# Altium project OnLab_Vezerlo.PrjPcb
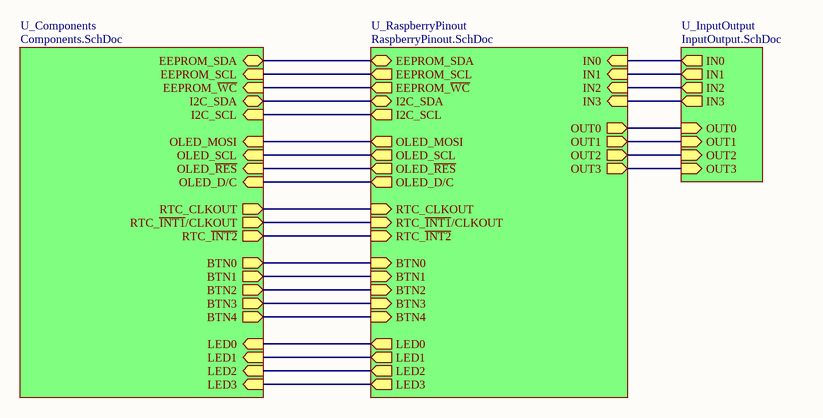
[diagram p0: TOP.SchDoc]
4 sheets, 86 parts. Net scope: hierarchical (ports join the sheet entries above them; power ports are global).
Board file: RaspberryHatBoard.PcbDoc
Sheets:
  TOP.SchDoc
    U_RaspberryPinout = RaspberryPinout.SchDoc
    U_Components = Components.SchDoc
    U_InputOutput = InputOutput.SchDoc

## Sheet TOP.SchDoc: Okos otthon vezérlő HAT
size A4; Author: Bencsik Dániel Zoltán; Organization: BME VIK AUT; DocumentNumber: 1; SheetNumber: 1; SheetTotal: 4

### Sub-sheets
U_Components = Components.SchDoc: EEPROM_SDA (bidir), EEPROM_SCL (in), EEPROM_~{WC} (in), RTC_~{INT1}/CLKOUT (out), RTC_CLKOUT (out), RTC_~{INT2} (out), LED0 (in), LED1 (in), LED2 (in), LED3 (in), BTN0 (out), BTN1 (out), BTN2 (out), BTN3 (out), BTN4 (out), OLED_SCL (in), OLED_MOSI (in), OLED_~{RES} (in), OLED_D/C (in), I2C_SCL (in), I2C_SDA (bidir)
U_InputOutput = InputOutput.SchDoc: IN0 (out), IN1 (out), IN2 (out), IN3 (out), OUT0 (in), OUT1 (in), OUT2 (in), OUT3 (in)
U_RaspberryPinout = RaspberryPinout.SchDoc: EEPROM_SDA (bidir), EEPROM_SCL (out), IN3 (in), IN2 (in), IN1 (in), IN0 (in), EEPROM_~{WC} (out), RTC_CLKOUT (in), RTC_~{INT1}/CLKOUT (in), BTN4 (in), BTN3 (in), BTN2 (in), BTN1 (in), BTN0 (in), RTC_~{INT2} (in), OLED_SCL (out), OLED_~{RES} (out), OLED_D/C (out), OLED_MOSI (out), LED3 (out), LED2 (out), LED1 (out), LED0 (out), I2C_SDA (bidir), I2C_SCL (out), OUT0 (out), OUT1 (out), OUT2 (out), OUT3 (out)

### Nets
NetC2_2: sheet U_RaspberryPinout/BTN0, sheet U_Components/BTN0
NetC3_2: sheet U_RaspberryPinout/BTN1, sheet U_Components/BTN1
NetC4_2: sheet U_RaspberryPinout/BTN2, sheet U_Components/BTN2
NetC5_2: sheet U_RaspberryPinout/BTN3, sheet U_Components/BTN3
NetC6_2: sheet U_RaspberryPinout/BTN4, sheet U_Components/BTN4
NetE1_5: sheet U_RaspberryPinout/EEPROM_SDA, sheet U_Components/EEPROM_SDA
NetE1_6: sheet U_RaspberryPinout/EEPROM_SCL, sheet U_Components/EEPROM_SCL
NetE1_7: sheet U_RaspberryPinout/EEPROM_~{WC}, sheet U_Components/EEPROM_~{WC}
NetIOE1_1: sheet U_RaspberryPinout/OUT0, sheet U_InputOutput/OUT0
NetIOE1_2: sheet U_RaspberryPinout/OUT1, sheet U_InputOutput/OUT1
NetIOE1_3: sheet U_RaspberryPinout/OUT2, sheet U_InputOutput/OUT2
NetIOE1_4: sheet U_RaspberryPinout/OUT3, sheet U_InputOutput/OUT3
NetIOE1_12: sheet U_RaspberryPinout/I2C_SCL, sheet U_Components/I2C_SCL
NetIOE1_13: sheet U_RaspberryPinout/I2C_SDA, sheet U_Components/I2C_SDA
NetIOE1_21: sheet U_RaspberryPinout/IN0, sheet U_InputOutput/IN0
NetIOE1_22: sheet U_RaspberryPinout/IN1, sheet U_InputOutput/IN1
NetIOE1_23: sheet U_RaspberryPinout/IN2, sheet U_InputOutput/IN2
NetIOE1_24: sheet U_RaspberryPinout/IN3, sheet U_InputOutput/IN3
NetOLED1_3: sheet U_RaspberryPinout/OLED_SCL, sheet U_Components/OLED_SCL
NetOLED1_4: sheet U_RaspberryPinout/OLED_MOSI, sheet U_Components/OLED_MOSI
NetOLED1_5: sheet U_RaspberryPinout/OLED_~{RES}, sheet U_Components/OLED_~{RES}
NetOLED1_6: sheet U_RaspberryPinout/OLED_D/C, sheet U_Components/OLED_D/C
NetP1_8: sheet U_RaspberryPinout/RTC_CLKOUT, sheet U_Components/RTC_CLKOUT
NetP1_10: sheet U_RaspberryPinout/RTC_~{INT1}/CLKOUT, sheet U_Components/RTC_~{INT1}/CLKOUT
NetP1_15: sheet U_RaspberryPinout/LED0, sheet U_Components/LED0
NetP1_16: sheet U_RaspberryPinout/LED1, sheet U_Components/LED1
NetP1_18: sheet U_RaspberryPinout/LED2, sheet U_Components/LED2
NetP1_22: sheet U_RaspberryPinout/LED3, sheet U_Components/LED3
NetP1_36: sheet U_RaspberryPinout/RTC_~{INT2}, sheet U_Components/RTC_~{INT2}

### Notes on the sheet
- Title
- Size:
- Date:
- A4
- Number:
- Time:
- Revision:
- Sheet
- of
- File:

## Sheet RaspberryPinout.SchDoc: Okosotthon vezérlő HAT
size A4; Author: Bencsik Dániel Zoltán; Organization: BME VIK AUT; DocumentNumber: 2; SheetNumber: 2; SheetTotal: 4
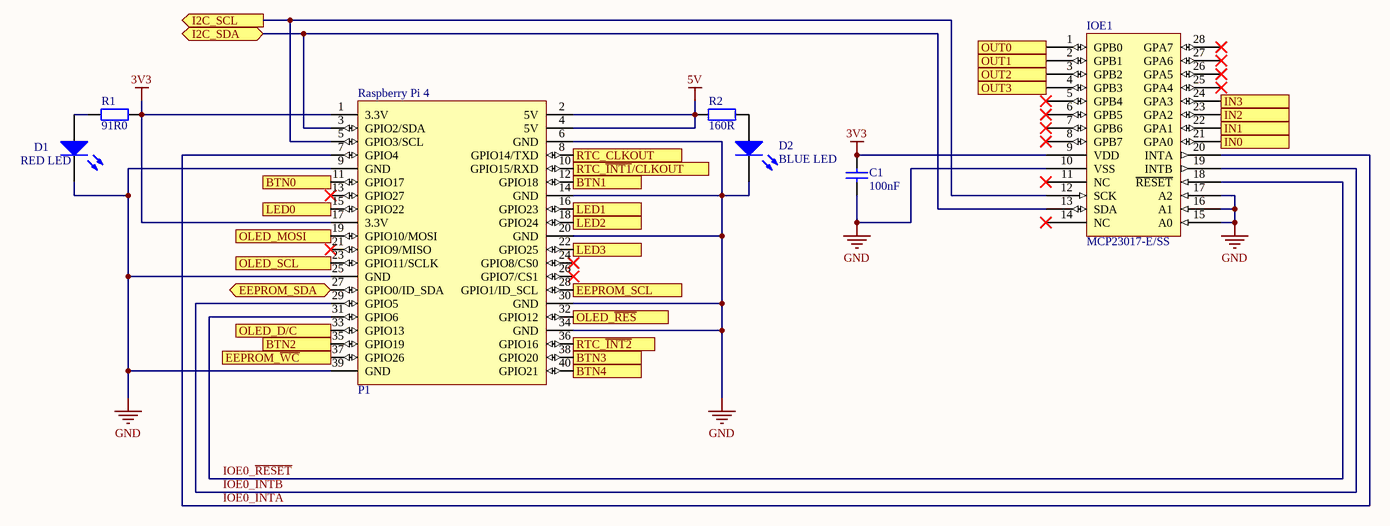
[diagram p1: RaspberryPinout.SchDoc]

### Parts
C1  100nF  [FP_0805_CAP_085]
D1  RED LED  [FP_0805_LED_RED]
D2  BLUE LED  [FP_0805_LED_BLUE]
IOE1  MCP23017-E/SS  [ONLAB_MCP23017-E/SS_SOP65P780X200-28N]
P1  Raspberry Pi 4  [ONLAB_RASPBERRY_4_BIG]
R1  91R0  [FP_0805_RES]
R2  160R  [FP_0805_RES]

### Ports
BTN0 (in), BTN1 (in), BTN2 (in), BTN3 (in), BTN4 (in), EEPROM_SCL (out), EEPROM_SDA (bidir), EEPROM_~{WC} (out), I2C_SCL (out), I2C_SDA (bidir), IN0 (in), IN1 (in), IN2 (in), IN3 (in), LED0 (out), LED1 (out), LED2 (out), LED3 (out), OLED_D/C (out), OLED_MOSI (out), OLED_SCL (out), OLED_~{RES} (out), OUT0 (out), OUT1 (out), OUT2 (out), OUT3 (out), RTC_CLKOUT (in), RTC_~{INT1}/CLKOUT (in), RTC_~{INT2} (in)

### Nets
3V3: C1.2 IOE1.9(VDD) P1.1(3.3V) P1.17(3.3V) R1.2
5V: P1.2(5V) P1.4(5V) R2.1
GND: C1.1 D1.K D2.K IOE1.10(VSS) IOE1.15(A0) IOE1.16(A1) IOE1.17(A2) P1.6(GND) P1.9(GND) P1.14(GND) P1.20(GND) P1.25(GND) P1.30(GND) P1.34(GND) P1.39(GND)
IOE0_INTA: IOE1.20(INTA) P1.7(GPIO4)
IOE0_INTB: IOE1.19(INTB) P1.29(GPIO5)
IOE0_~{RESET}: IOE1.18(~{RESET}) P1.31(GPIO6)
NetC2_2: P1.11(GPIO17) ; port BTN0
NetC3_2: P1.12(GPIO18) ; port BTN1
NetC4_2: P1.35(GPIO19) ; port BTN2
NetC5_2: P1.38(GPIO20) ; port BTN3
NetC6_2: P1.40(GPIO21) ; port BTN4
NetD1_A: D1.A R1.1
NetD2_A: D2.A R2.2
NetE1_5: P1.27(GPIO0/ID_SDA) ; port EEPROM_SDA
NetE1_6: P1.28(GPIO1/ID_SCL) ; port EEPROM_SCL
NetE1_7: P1.37(GPIO26) ; port EEPROM_~{WC}
NetIOE1_1: IOE1.1(GPB0) ; port OUT0
NetIOE1_2: IOE1.2(GPB1) ; port OUT1
NetIOE1_3: IOE1.3(GPB2) ; port OUT2
NetIOE1_4: IOE1.4(GPB3) ; port OUT3
NetIOE1_12: IOE1.12(SCK) P1.5(GPIO3/SCL) ; port I2C_SCL
NetIOE1_13: IOE1.13(SDA) P1.3(GPIO2/SDA) ; port I2C_SDA
NetIOE1_21: IOE1.21(GPA0) ; port IN0
NetIOE1_22: IOE1.22(GPA1) ; port IN1
NetIOE1_23: IOE1.23(GPA2) ; port IN2
NetIOE1_24: IOE1.24(GPA3) ; port IN3
NetOLED1_3: P1.23(GPIO11/SCLK) ; port OLED_SCL
NetOLED1_4: P1.19(GPIO10/MOSI) ; port OLED_MOSI
NetOLED1_5: P1.32(GPIO12) ; port OLED_~{RES}
NetOLED1_6: P1.33(GPIO13) ; port OLED_D/C
NetP1_8: P1.8(GPIO14/TXD) ; port RTC_CLKOUT
NetP1_10: P1.10(GPIO15/RXD) ; port RTC_~{INT1}/CLKOUT
NetP1_15: P1.15(GPIO22) ; port LED0
NetP1_16: P1.16(GPIO23) ; port LED1
NetP1_18: P1.18(GPIO24) ; port LED2
NetP1_22: P1.22(GPIO25) ; port LED3
NetP1_36: P1.36(GPIO16) ; port RTC_~{INT2}

Not connected (* = marked no-connect by the designer): IOE1 5(GPB4)* 6(GPB5)* 7(GPB6)* 8(GPB7)* 11(NC)* 14(NC)* 25(GPA4)* 26(GPA5)* 27(GPA6)* 28(GPA7)*; P1 13(GPIO27)* 21(GPIO9/MISO)* 24(GPIO8/CS0)* 26(GPIO7/CS1)*

### Notes on the sheet
- Title
- Size:
- Date:
- A4
- Number:
- Time:
- Revision:
- Sheet
- of
- File:

### Library data of the parts
C1 = CAP: Capacitor; Value: 100nF
D1 D2 = LED: Typical RED GaAs LED
IOE1 = MCP23017-E/SS: I/O Expander, 16bit, 1.7 MHz, I2C, Serial, 4.5 V, 5.5 V, SSOP
R1 R2 = RES: Resistor
  R1: Value: 91R0
  R2: Value: 160R

## Sheet Components.SchDoc: Okosotthon vezérlő HAT
size A4; Author: Bencsik Dániel Zoltán; Organization: BME VIK AUT; DocumentNumber: 3; SheetNumber: 3; SheetTotal: 4
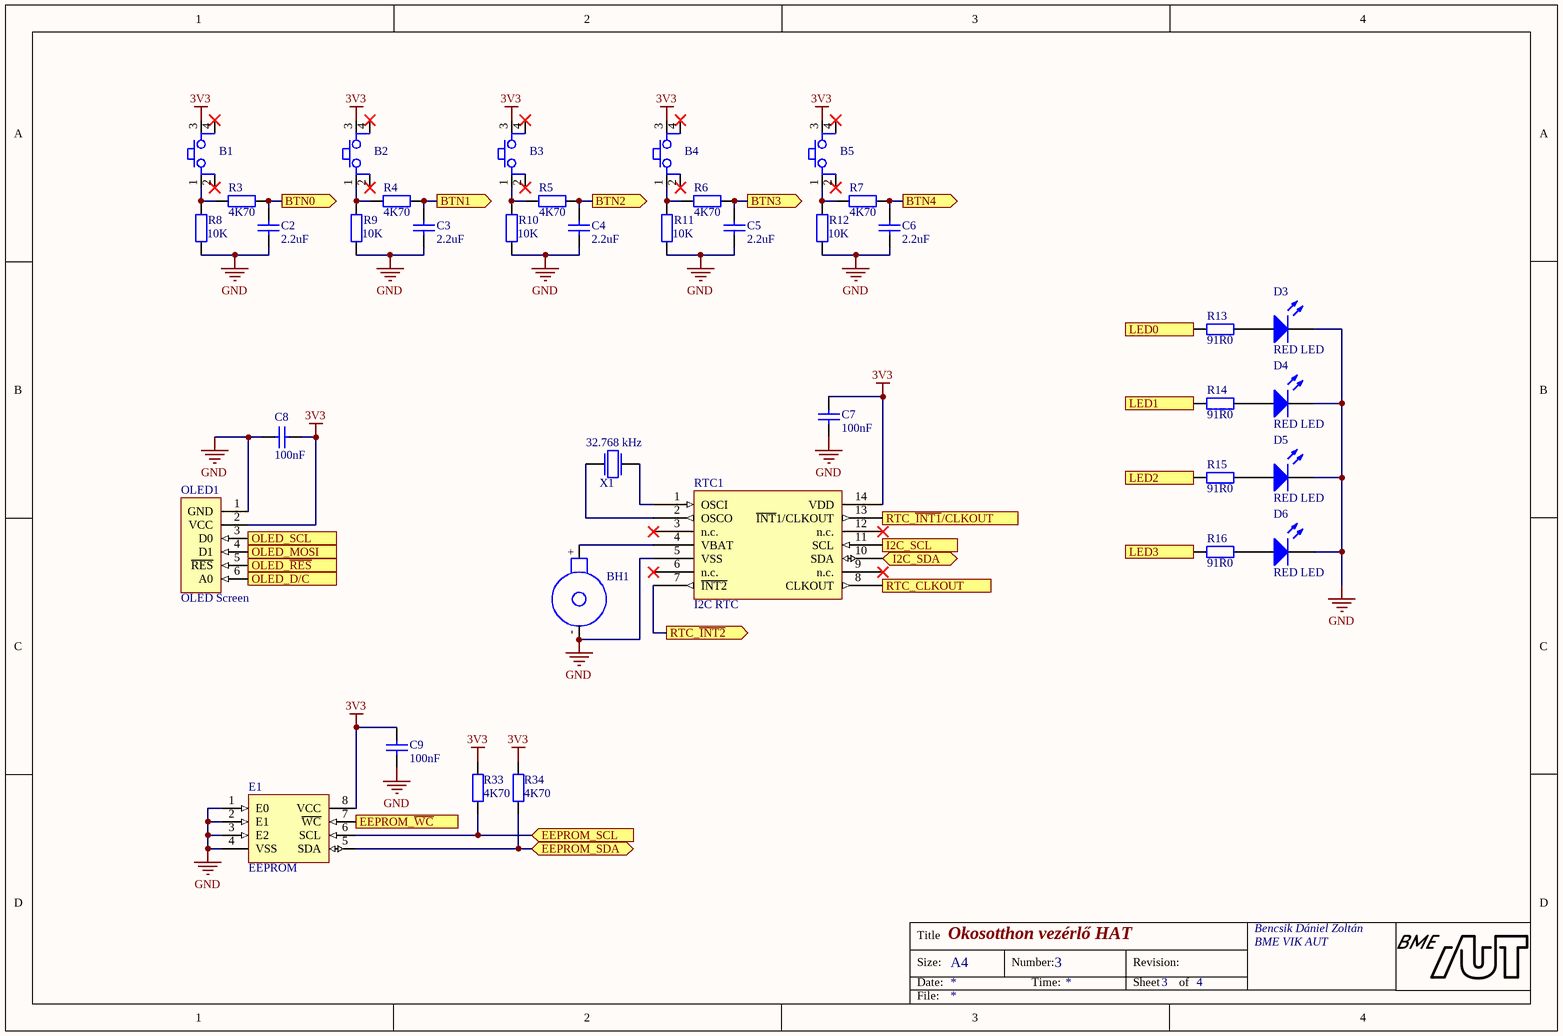
[diagram p2: Components.SchDoc]

### Parts
B1  Button  [FP_BTN_SMD]  (value not drawn)
B2  Button  [FP_BTN_SMD]  (value not drawn)
B3  Button  [FP_BTN_SMD]  (value not drawn)
B4  Button  [FP_BTN_SMD]  (value not drawn)
B5  Button  [FP_BTN_SMD]  (value not drawn)
BH1  Battery Holder  [ONLAB_ELEMTARTO]  (value not drawn)
C2  2.2uF  [FP_0805_CAP_085]
C3  2.2uF  [FP_0805_CAP_085]
C4  2.2uF  [FP_0805_CAP_085]
C5  2.2uF  [FP_0805_CAP_085]
C6  2.2uF  [FP_0805_CAP_085]
C7  100nF  [FP_0805_CAP_085]
C8  100nF  [FP_0805_CAP_085]
C9  100nF  [FP_0805_CAP_085]
D3  RED LED  [FP_0805_LED_RED]
D4  RED LED  [FP_0805_LED_RED]
D5  RED LED  [FP_0805_LED_RED]
D6  RED LED  [FP_0805_LED_RED]
E1  EEPROM  [ONLAB_M24C64-WMN6TP_SO-8_STM]
OLED1  OLED Screen  [ONLAB_OLED_D096-12864-SPI6]
R3  4K70  [FP_0805_RES]
R4  4K70  [FP_0805_RES]
R5  4K70  [FP_0805_RES]
R6  4K70  [FP_0805_RES]
R7  4K70  [FP_0805_RES]
R8  10K  [FP_0805_RES]
R9  10K  [FP_0805_RES]
R10  10K  [FP_0805_RES]
R11  10K  [FP_0805_RES]
R12  10K  [FP_0805_RES]
R13  91R0  [FP_0805_RES]
R14  91R0  [FP_0805_RES]
R15  91R0  [FP_0805_RES]
R16  91R0  [FP_0805_RES]
R33  4K70  [FP_0603_RES]
R34  4K70  [FP_0603_RES]
RTC1  I2C RTC  [ONLAB_PCF8523TS/1,118_TSSOP-14]
X1  32.768 kHz  [ONLAB_XTAL_LFXTAL050789_IQD]

### Ports
BTN0 (out), BTN1 (out), BTN2 (out), BTN3 (out), BTN4 (out), EEPROM_SCL (in), EEPROM_SDA (bidir), EEPROM_~{WC} (in), I2C_SCL (in), I2C_SDA (bidir), LED0 (in), LED1 (in), LED2 (in), LED3 (in), OLED_D/C (in), OLED_MOSI (in), OLED_SCL (in), OLED_~{RES} (in), RTC_CLKOUT (out), RTC_~{INT1}/CLKOUT (out), RTC_~{INT2} (out)

### Nets
3V3: B1.3 B2.3 B3.3 B4.3 B5.3 C7.1 C8.2 C9.1 E1.8(VCC) OLED1.2(VCC) R33.2 R34.2 RTC1.14(VDD)
GND: BH1.- C2.1 C3.1 C4.1 C5.1 C6.1 C7.2 C8.1 C9.2 D3.K D4.K D5.K D6.K E1.1(E0) E1.2(E1) E1.3(E2) E1.4(VSS) OLED1.1(GND) R8.1 R9.1 R10.1 R11.1 R12.1 RTC1.5(VSS)
NetB1_1: B1.1 R3.1 R8.2
NetB2_1: B2.1 R4.1 R9.2
NetB3_1: B3.1 R5.1 R10.2
NetB4_1: B4.1 R6.1 R11.2
NetB5_1: B5.1 R7.1 R12.2
NetBH1_+: BH1.+ RTC1.4(VBAT)
NetC2_2: C2.2 R3.2 ; port BTN0
NetC3_2: C3.2 R4.2 ; port BTN1
NetC4_2: C4.2 R5.2 ; port BTN2
NetC5_2: C5.2 R6.2 ; port BTN3
NetC6_2: C6.2 R7.2 ; port BTN4
NetD3_A: D3.A R13.2
NetD4_A: D4.A R14.2
NetD5_A: D5.A R15.2
NetD6_A: D6.A R16.2
NetE1_5: E1.5(SDA) R34.1 ; port EEPROM_SDA
NetE1_6: E1.6(SCL) R33.1 ; port EEPROM_SCL
NetE1_7: E1.7(~{WC}) ; port EEPROM_~{WC}
NetIOE1_12: RTC1.11(SCL) ; port I2C_SCL
NetIOE1_13: RTC1.10(SDA) ; port I2C_SDA
NetOLED1_3: OLED1.3(D0) ; port OLED_SCL
NetOLED1_4: OLED1.4(D1) ; port OLED_MOSI
NetOLED1_5: OLED1.5(~{RES}) ; port OLED_~{RES}
NetOLED1_6: OLED1.6(A0) ; port OLED_D/C
NetP1_8: RTC1.8(CLKOUT) ; port RTC_CLKOUT
NetP1_10: RTC1.13(~{INT}1/CLKOUT) ; port RTC_~{INT1}/CLKOUT
NetP1_15: R13.1 ; port LED0
NetP1_16: R14.1 ; port LED1
NetP1_18: R15.1 ; port LED2
NetP1_22: R16.1 ; port LED3
NetP1_36: RTC1.7(~{INT2}) ; port RTC_~{INT2}
NetRTC1_1: RTC1.1(OSCI) X1.2
NetRTC1_2: RTC1.2(OSCO) X1.1

Not connected (* = marked no-connect by the designer): B1 2* 4*; B2 2* 4*; B3 2* 4*; B4 2* 4*; B5 2* 4*; RTC1 3(n.c.)* 6(n.c.)* 9(n.c.)* 12(n.c.)*

### Notes on the sheet
- Title
- Size:
- Date:
- A4
- Number:
- Time:
- Revision:
- Sheet
- of
- File:

### Library data of the parts
B1-B5 = Button 4P: Push button
BH1 = Battery Holder: ELEMTARTÓ 1x2032 BH2032-3P (T-T) NYÁK FEKVŐ /CR2032/
C2-C9 = CAP: Capacitor
  C2-C6: Value: 2.2uF
  C7-C9: Value: 100nF
D3-D6 = LED: Typical RED GaAs LED
E1 = EEPROM: M24C64-WMN6TP (STM) 64Kbit I2C-BUS MEM. SERIAL 8Kx8 EEPROM SO-8
OLED1 = OLED Screen: 128x64 OLED, SPI interfész
R3-R16 R33 R34 = RES: Resistor
  R3-R7 R33 R34: Value: 4K70
  R8-R12: Value: 10K
  R13-R16: Value: 91R0
RTC1 = RTC_TSSOP-14: PCF8523TS/1,118 Calendar, Clock IC, Year/Month/Week/Date/Hr/Min/Sec Binary, I2C, 1.2 V to 5.5 V, TSSOP-14
X1 = Crystal: Quarz Crystal; Value: 32.768 kHz

## Sheet InputOutput.SchDoc: Okosotthon vezérlő HAT
size A4; Author: Bencsik Dániel Zoltán; Organization: BME VIK AUT; DocumentNumber: 4; SheetNumber: 4; SheetTotal: 4
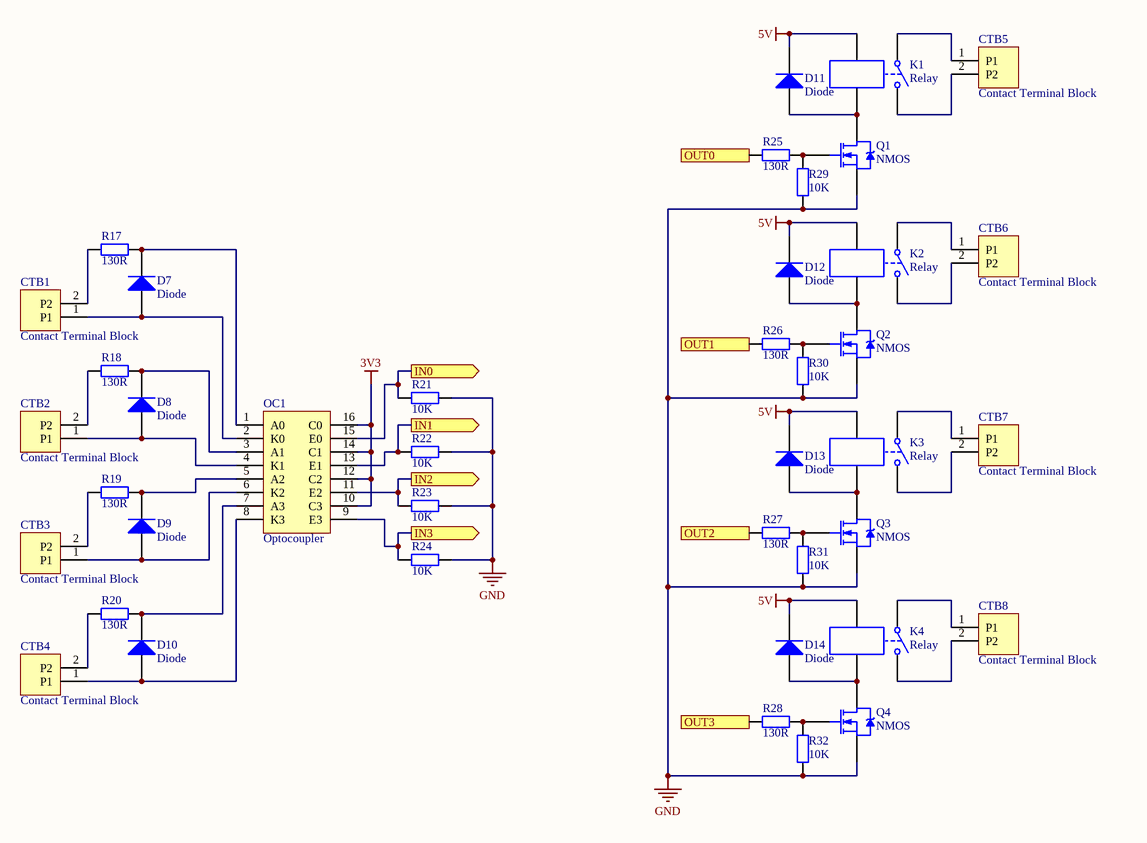
[diagram p3: InputOutput.SchDoc]

### Parts
CTB1  Contact Terminal Block  [ONLAB_SORK_2_RN3.50]
CTB2  Contact Terminal Block  [ONLAB_SORK_2_RN3.50]
CTB3  Contact Terminal Block  [ONLAB_SORK_2_RN3.50]
CTB4  Contact Terminal Block  [ONLAB_SORK_2_RN3.50]
CTB5  Contact Terminal Block  [ONLAB_SORK_2_RN3.50]
CTB6  Contact Terminal Block  [ONLAB_SORK_2_RN3.50]
CTB7  Contact Terminal Block  [ONLAB_SORK_2_RN3.50]
CTB8  Contact Terminal Block  [ONLAB_SORK_2_RN3.50]
D7  Diode  [ONLAB_SMA_DO-214AC]
D8  Diode  [ONLAB_SMA_DO-214AC]
D9  Diode  [ONLAB_SMA_DO-214AC]
D10  Diode  [ONLAB_SMA_DO-214AC]
D11  Diode  [ONLAB_SMA_DO-214AC]
D12  Diode  [ONLAB_SMA_DO-214AC]
D13  Diode  [ONLAB_SMA_DO-214AC]
D14  Diode  [ONLAB_SMA_DO-214AC]
K1  Relay  [ONLAB_RELAY_ALQ305]
K2  Relay  [ONLAB_RELAY_ALQ305]
K3  Relay  [ONLAB_RELAY_ALQ305]
K4  Relay  [ONLAB_RELAY_ALQ305]
OC1  Optocoupler  [ONLAB_OPTO_TLP290-4]
Q1  NMOS  [ONLAB_2N7002_SOT23127P600-8N]
Q2  NMOS  [ONLAB_2N7002_SOT23127P600-8N]
Q3  NMOS  [ONLAB_2N7002_SOT23127P600-8N]
Q4  NMOS  [ONLAB_2N7002_SOT23127P600-8N]
R17  130R  [FP_0805_RES]
R18  130R  [FP_0805_RES]
R19  130R  [FP_0805_RES]
R20  130R  [FP_0805_RES]
R21  10K  [FP_0805_RES]
R22  10K  [FP_0805_RES]
R23  10K  [FP_0805_RES]
R24  10K  [FP_0805_RES]
R25  130R  [FP_0805_RES]
R26  130R  [FP_0805_RES]
R27  130R  [FP_0805_RES]
R28  130R  [FP_0805_RES]
R29  10K  [FP_0805_RES]
R30  10K  [FP_0805_RES]
R31  10K  [FP_0805_RES]
R32  10K  [FP_0805_RES]

### Ports
IN0 (out), IN1 (out), IN2 (out), IN3 (out), OUT0 (in), OUT1 (in), OUT2 (in), OUT3 (in)

### Nets
3V3: OC1.10(C3) OC1.12(C2) OC1.14(C1) OC1.16(C0)
5V: D11.2(K) D12.2(K) D13.2(K) D14.2(K) K1.3 K2.3 K3.3 K4.3
GND: Q1.3(S) Q2.3(S) Q3.3(S) Q4.3(S) R21.2 R22.2 R23.2 R24.2 R29.1 R30.1 R31.1 R32.1
NetCTB1_1: CTB1.1(P1) D7.1(A) OC1.2(K0)
NetCTB1_2: CTB1.2(P2) R17.1
NetCTB2_1: CTB2.1(P1) D8.1(A) OC1.4(K1)
NetCTB2_2: CTB2.2(P2) R18.1
NetCTB3_1: CTB3.1(P1) D9.1(A) OC1.6(K2)
NetCTB3_2: CTB3.2(P2) R19.1
NetCTB4_1: CTB4.1(P1) D10.1(A) OC1.8(K3)
NetCTB4_2: CTB4.2(P2) R20.1
NetCTB5_1: CTB5.1(P1) K1.1
NetCTB5_2: CTB5.2(P2) K1.2
NetCTB6_1: CTB6.1(P1) K2.1
NetCTB6_2: CTB6.2(P2) K2.2
NetCTB7_1: CTB7.1(P1) K3.1
NetCTB7_2: CTB7.2(P2) K3.2
NetCTB8_1: CTB8.1(P1) K4.1
NetCTB8_2: CTB8.2(P2) K4.2
NetD7_2: D7.2(K) OC1.1(A0) R17.2
NetD8_2: D8.2(K) OC1.3(A1) R18.2
NetD9_2: D9.2(K) OC1.5(A2) R19.2
NetD10_2: D10.2(K) OC1.7(A3) R20.2
NetD11_1: D11.1(A) K1.4 Q1.2(D)
NetD12_1: D12.1(A) K2.4 Q2.2(D)
NetD13_1: D13.1(A) K3.4 Q3.2(D)
NetD14_1: D14.1(A) K4.4 Q4.2(D)
NetIOE1_1: R25.1 ; port OUT0
NetIOE1_2: R26.1 ; port OUT1
NetIOE1_3: R27.1 ; port OUT2
NetIOE1_4: R28.1 ; port OUT3
NetIOE1_21: OC1.15(E0) R21.1 ; port IN0
NetIOE1_22: OC1.13(E1) R22.1 ; port IN1
NetIOE1_23: OC1.11(E2) R23.1 ; port IN2
NetIOE1_24: OC1.9(E3) R24.1 ; port IN3
NetQ1_1: Q1.1(G) R25.2 R29.2
NetQ2_1: Q2.1(G) R26.2 R30.2
NetQ3_1: Q3.1(G) R27.2 R31.2
NetQ4_1: Q4.1(G) R28.2 R32.2

### Notes on the sheet
- Title
- Size:
- Date:
- A4
- Number:
- Time:
- Revision:
- Sheet
- of
- File:

### Library data of the parts
CTB1-CTB8 = CTB: SORKAPOCS 2 P RM3.50 CPP3.5/2 (STE) LIFTES 1mmř 10A
D7-D14 = Diode: Default Diode; pin to pad: 1>A 2>K; Published: 8-Jun-2000; LatestRevisionDate: 17-Jul-2002; LatestRevisionNote: Re-released for DXP Platform.; PackageVersion: Sep-1996; PackageReference: SMC; Publisher: Altium Limited; PackageDescription: DO-214-AB/SMC; 2 C-Bend Leads; Body 7.9 x 5.9 mm, inc. leads (LxW); Code_JEDEC: DO-214-AB
K1-K4 = Relay-SPST: Single-Pole Single-Throw Relay; pin to pad: 1>COM 2>NO 3>C2 4>C1; Published: 24-Mar-1999; LatestRevisionDate: 17-Jul-2002; LatestRevisionNote: Re-released for DXP Platform.; PackageReference: MODULE4; Publisher: Altium Limited
OC1 = Optocoupler: TLP293-4 TOSHIBA PHOTOCOUPLER InGaAs IRED & PHOTO-TRANSISTOR
Q1-Q4 = NMOS: NXP - BSP030,115 - MOSFET, N CH, 30V, 10A, SOT223; pin to pad: 1>G 2>D 3>S
R17-R32 = RES: Resistor
  R17-R20 R25-R28: Value: 130R
  R21-R24 R29-R32: Value: 10K

## Nets that join several sheets
3V3: RaspberryPinout (5 pins), Components (13 pins), InputOutput (OC1.10 OC1.12 OC1.14 OC1.16)
5V: RaspberryPinout (P1.2 P1.4 R2.1), InputOutput (8 pins)
GND: RaspberryPinout (15 pins), Components (24 pins), InputOutput (12 pins)
NetC2_2: RaspberryPinout (P1.11), Components (C2.2 R3.2)
NetC3_2: RaspberryPinout (P1.12), Components (C3.2 R4.2)
NetC4_2: RaspberryPinout (P1.35), Components (C4.2 R5.2)
NetC5_2: RaspberryPinout (P1.38), Components (C5.2 R6.2)
NetC6_2: RaspberryPinout (P1.40), Components (C6.2 R7.2)
NetE1_5: RaspberryPinout (P1.27), Components (E1.5 R34.1)
NetE1_6: RaspberryPinout (P1.28), Components (E1.6 R33.1)
NetE1_7: RaspberryPinout (P1.37), Components (E1.7)
NetIOE1_1: RaspberryPinout (IOE1.1), InputOutput (R25.1)
NetIOE1_2: RaspberryPinout (IOE1.2), InputOutput (R26.1)
NetIOE1_3: RaspberryPinout (IOE1.3), InputOutput (R27.1)
NetIOE1_4: RaspberryPinout (IOE1.4), InputOutput (R28.1)
NetIOE1_12: RaspberryPinout (IOE1.12 P1.5), Components (RTC1.11)
NetIOE1_13: RaspberryPinout (IOE1.13 P1.3), Components (RTC1.10)
NetIOE1_21: RaspberryPinout (IOE1.21), InputOutput (OC1.15 R21.1)
NetIOE1_22: RaspberryPinout (IOE1.22), InputOutput (OC1.13 R22.1)
NetIOE1_23: RaspberryPinout (IOE1.23), InputOutput (OC1.11 R23.1)
NetIOE1_24: RaspberryPinout (IOE1.24), InputOutput (OC1.9 R24.1)
NetOLED1_3: RaspberryPinout (P1.23), Components (OLED1.3)
NetOLED1_4: RaspberryPinout (P1.19), Components (OLED1.4)
NetOLED1_5: RaspberryPinout (P1.32), Components (OLED1.5)
NetOLED1_6: RaspberryPinout (P1.33), Components (OLED1.6)
NetP1_8: RaspberryPinout (P1.8), Components (RTC1.8)
NetP1_10: RaspberryPinout (P1.10), Components (RTC1.13)
NetP1_15: RaspberryPinout (P1.15), Components (R13.1)
NetP1_16: RaspberryPinout (P1.16), Components (R14.1)
NetP1_18: RaspberryPinout (P1.18), Components (R15.1)
NetP1_22: RaspberryPinout (P1.22), Components (R16.1)
NetP1_36: RaspberryPinout (P1.36), Components (RTC1.7)